# EAGLE design TQFP-DIP (EAGLE 6.1)
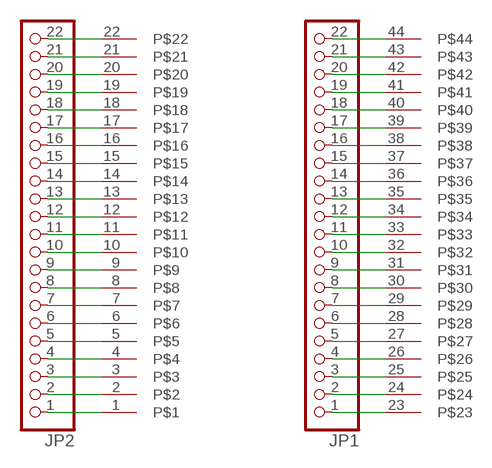
[diagram p0: schematic, sheet 1]

## Parts
JP1  PINHD-1X22  [1X22]
JP2  PINHD-1X22  [1X22]
U$1  TQFP44  [TQFP44]

## Nets
N$1: JP2.1 U$1.1
N$2: JP2.2 U$1.2
N$3: JP2.3 U$1.3
N$4: JP2.4 U$1.4
N$5: JP2.5 U$1.5
N$6: JP2.6 U$1.6
N$7: JP2.7 U$1.7
N$8: JP2.8 U$1.8
N$9: JP2.9 U$1.9
N$10: JP2.10 U$1.10
N$11: JP2.11 U$1.11
N$12: JP2.12 U$1.12
N$13: JP2.13 U$1.13
N$14: JP2.14 U$1.14
N$15: JP2.15 U$1.15
N$16: JP2.16 U$1.16
N$17: JP2.17 U$1.17
N$18: JP2.18 U$1.18
N$19: JP2.19 U$1.19
N$20: JP2.20 U$1.20
N$21: JP2.21 U$1.21
N$22: JP2.22 U$1.22
N$23: JP1.1 U$1.23
N$24: JP1.2 U$1.24
N$25: JP1.3 U$1.25
N$26: JP1.4 U$1.26
N$27: JP1.5 U$1.27
N$28: JP1.6 U$1.28
N$29: JP1.7 U$1.29
N$30: JP1.8 U$1.30
N$31: JP1.9 U$1.31
N$32: JP1.10 U$1.32
N$33: JP1.11 U$1.33
N$34: JP1.12 U$1.34
N$35: JP1.13 U$1.35
N$36: JP1.14 U$1.36
N$37: JP1.15 U$1.37
N$38: JP1.16 U$1.38
N$39: JP1.17 U$1.39
N$40: JP1.18 U$1.40
N$41: JP1.19 U$1.41
N$42: JP1.20 U$1.42
N$43: JP1.21 U$1.43
N$44: JP1.22 U$1.44

## Library data of the parts
JP1 JP2 = pinhead:PINHD-1X22: PIN HEADER
U$1 = SparkFun:TQFP44

## Board
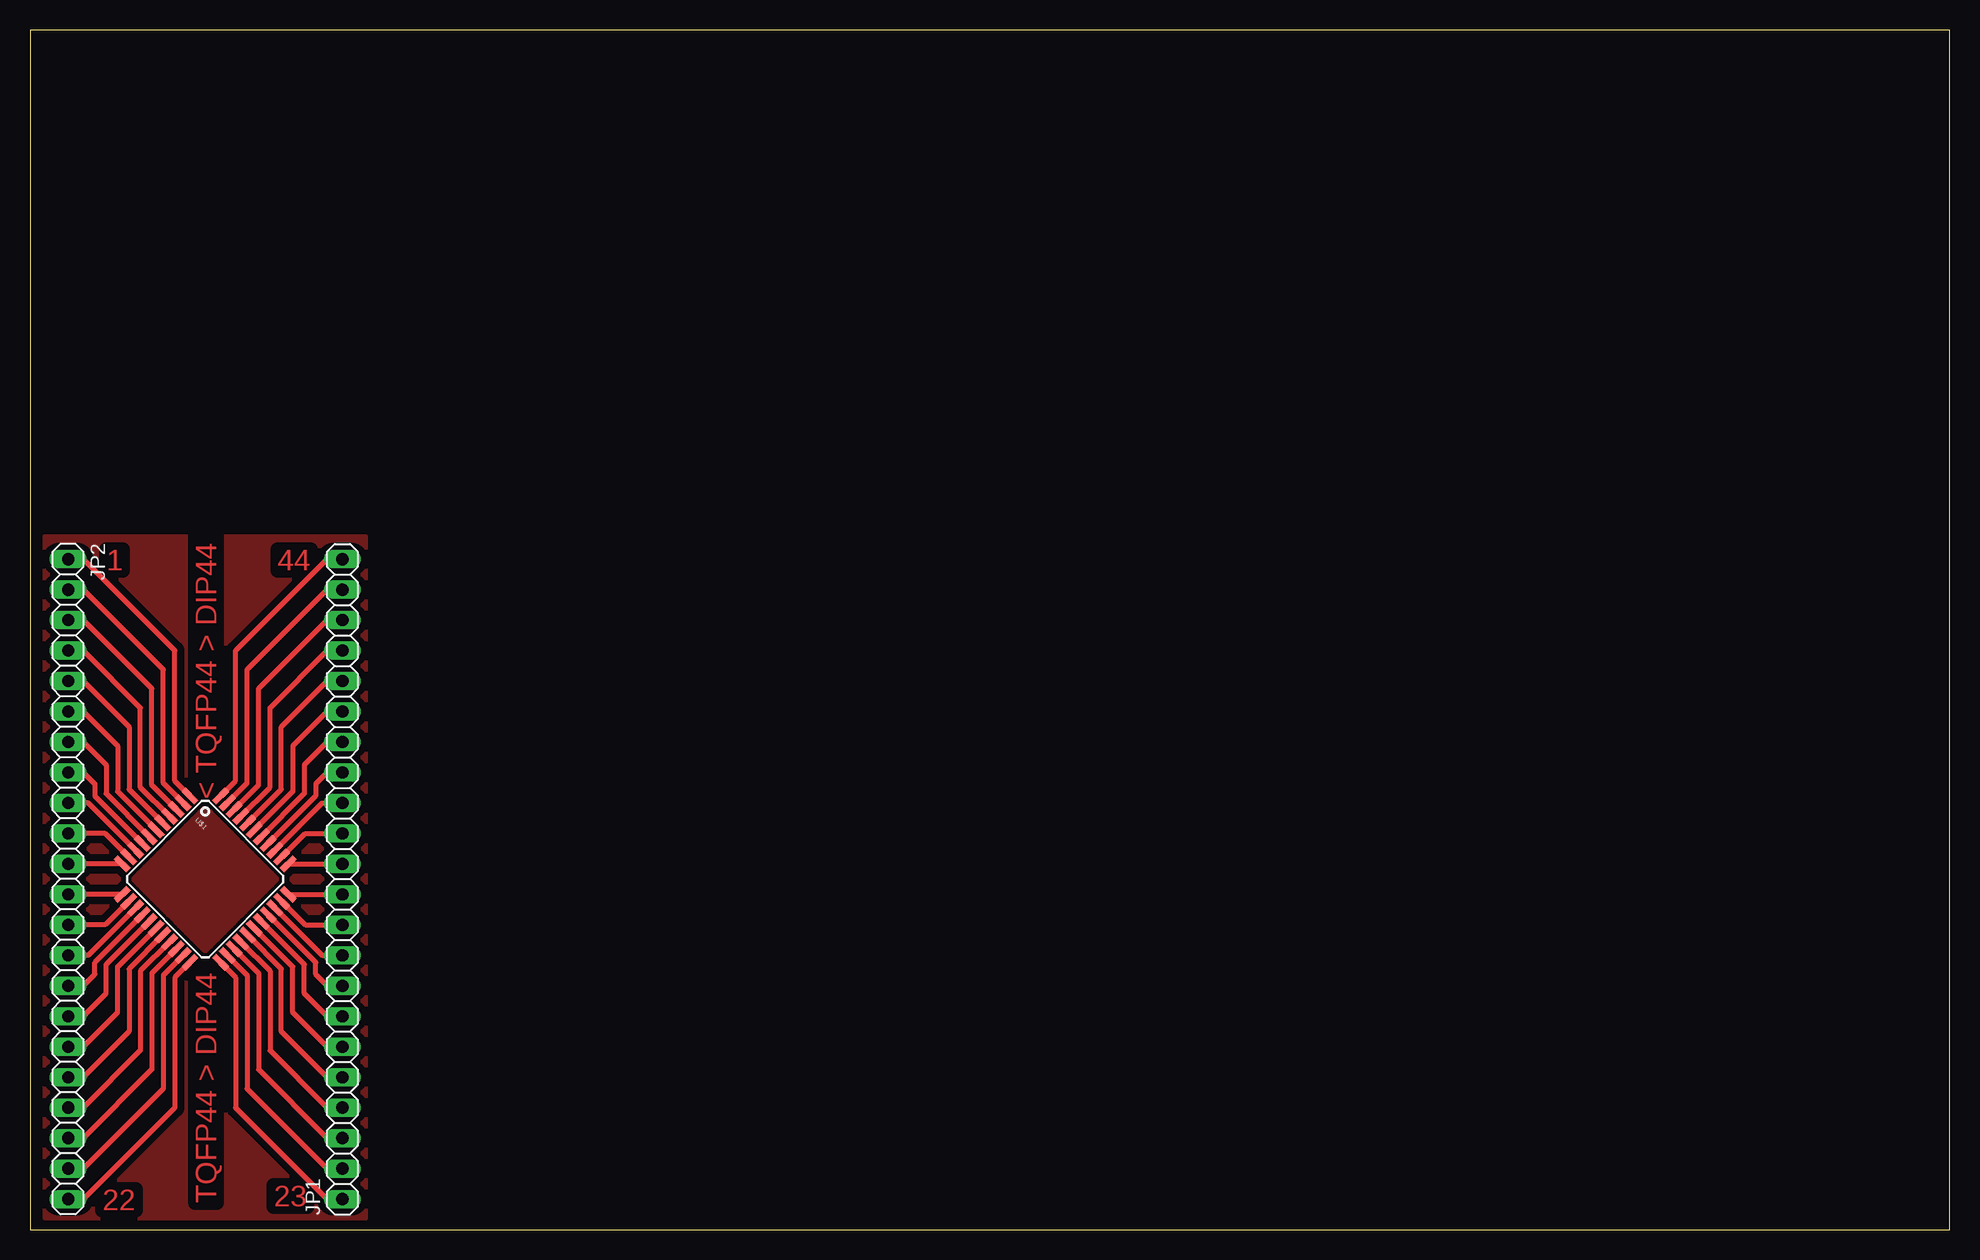
[diagram p1: board, top side]

Size 160 x 100 mm. Coordinates in mm from the lower left corner, seen from the top.
Outline: 0,0 160,0 160,100 0,100 0,0
Copper layers (1*16): Top 0.035mm / dielectric 1.5mm / Bottom 0.035mm
Design rules: minimum track width 10mil, minimum drill 24mil, track to track 12mil, track to pad 12mil, pad to pad 12mil, via to via 12mil, smd to smd 10mil, copper to edge 12mil, drill to drill 12mil, minimum pad ring 10mil, minimum via ring 10mil, stop-mask expansion 4mil, vias tented up to drill 0mil, thermal gap 12mil

### Footprints (pad centres in the part's own frame; a part is rotated, then mirrored left to right if it is on the bottom)
1X22 = drill 1.016 long: 1 -26.67,0; 2 -24.13,0; 3 -21.59,0; 4 -19.05,0; 5 -16.51,0; 6 -13.97,0; 7 -11.43,0; 8 -8.89,0; 9 -6.35,0; 10 -3.81,0; 11 -1.27,0; 12 1.27,0; 13 3.81,0; 14 6.35,0; 15 8.89,0; 16 11.43,0; 17 13.97,0; 18 16.51,0; 19 19.05,0; 20 21.59,0; 21 24.13,0; 22 26.67,0
TQFP44 = smd 1.5 x 0.5: 1 -5.8,4; 2 -5.8,3.2; 3 -5.8,2.4; 4 -5.8,1.6; 5 -5.8,0.8; 6 -5.8,0; 7 -5.8,-0.8; 8 -5.8,-1.6; 9 -5.8,-2.4; 10 -5.8,-3.2; 11 -5.8,-4; 23 5.8,-4; 24 5.8,-3.2; 25 5.8,-2.4; 26 5.8,-1.6; 27 5.8,-0.8; 28 5.8,0; 29 5.8,0.8; 30 5.8,1.6; 31 5.8,2.4; 32 5.8,3.2; 33 5.8,4 | smd 0.5 x 1.5: 12 -4,-5.8; 13 -3.2,-5.8; 14 -2.4,-5.8; 15 -1.6,-5.8; 16 -0.8,-5.8; 17 0,-5.8; 18 0.8,-5.8; 19 1.6,-5.8; 20 2.4,-5.8; 21 3.2,-5.8; 22 4,-5.8; 34 4,5.8; 35 3.2,5.8; 36 2.4,5.8; 37 1.6,5.8; 38 0.8,5.8; 39 0,5.8; 40 -0.8,5.8; 41 -1.6,5.8; 42 -2.4,5.8; 43 -3.2,5.8; 44 -4,5.8

### Placement (x,y rotation side)
JP1  26.04,29.21 90 top
JP2  3.17,29.21 270 top
U$1  14.61,29.21 315 top

### Tracks (layer width: path | path; a pad name or v marks a point on that pad's centre or on a via)
N$1
  Top 0.406: JP2.1 4.45,55.88 12.06,48.26 12.06,37.41 U$1.1
N$2
  Top 0.406: JP2.2 4.45,53.34 11.11,46.67 11.11,37.23 U$1.2
N$3
  Top 0.406: JP2.3 4.45,50.8 10.16,45.09 10.16,37.05 U$1.3
N$4
  Top 0.406: JP2.4 4.45,48.26 9.21,43.5 9.21,36.87 U$1.4
N$5
  Top 0.406: JP2.5 4.45,45.72 8.26,41.91 8.26,36.69 U$1.5
N$6
  Top 0.406: JP2.6 4.45,43.18 7.3,40.32 7.3,36.51 U$1.6
N$7
  Top 0.406: JP2.7 4.45,40.64 6.35,38.73 6.35,36.33 U$1.7
N$8
  Top 0.406: JP2.8 4.45,38.1 5.4,37.15 5.4,36.16 U$1.8
N$9
  Top 0.406: U$1.9 4.86,35.56 JP2.9
N$10
  Top 0.406: U$1.10 6.27,33.02 JP2.10
N$11
  Top 0.406: U$1.11 JP2.11
N$12
  Top 0.406: U$1.12 JP2.12
N$13
  Top 0.406: U$1.13 6.27,25.4 JP2.13
N$14
  Top 0.406: U$1.14 4.86,22.86 JP2.14
N$15
  Top 0.406: JP2.15 4.45,20.32 5.4,21.27 5.4,22.27 U$1.15
N$16
  Top 0.406: JP2.16 4.45,17.78 6.35,19.68 6.35,22.09 U$1.16
N$17
  Top 0.406: JP2.17 4.45,15.24 7.3,18.1 7.3,21.91 U$1.17
N$18
  Top 0.406: JP2.18 4.45,12.7 8.26,16.51 8.26,21.73 U$1.18
N$19
  Top 0.406: JP2.19 4.45,10.16 9.21,14.92 9.21,21.55 U$1.19
N$20
  Top 0.406: JP2.20 4.45,7.62 10.16,13.34 10.16,21.37 U$1.20
N$21
  Top 0.406: JP2.21 4.45,5.08 11.11,11.75 11.11,21.19 U$1.21
N$22
  Top 0.406: JP2.22 4.45,2.54 12.06,10.16 12.06,21.01 U$1.22
N$23
  Top 0.406: JP1.1 24.77,2.54 17.14,10.16 17.14,21.01 U$1.23
N$24
  Top 0.406: JP1.2 24.77,5.08 18.1,11.75 18.1,21.19 U$1.24
N$25
  Top 0.406: JP1.3 24.77,7.62 19.05,13.34 19.05,21.37 U$1.25
N$26
  Top 0.406: JP1.4 24.77,10.16 20,14.92 20,21.55 U$1.26
N$27
  Top 0.406: JP1.5 24.77,12.7 20.95,16.51 20.95,21.73 U$1.27
N$28
  Top 0.406: JP1.6 24.77,15.24 21.91,18.1 21.91,21.91 U$1.28
N$29
  Top 0.406: JP1.7 24.77,17.78 22.86,19.68 22.86,22.09 U$1.29
N$30
  Top 0.406: JP1.8 24.77,20.32 23.81,21.27 23.81,22.27 U$1.30
N$31
  Top 0.406: U$1.31 24.35,22.86 JP1.9
N$32
  Top 0.406: U$1.32 22.94,25.4 JP1.10
N$33
  Top 0.406: U$1.33 JP1.11
N$34
  Top 0.406: U$1.34 JP1.12
N$35
  Top 0.406: U$1.35 22.94,33.02 JP1.13
N$36
  Top 0.406: U$1.36 24.35,35.56 JP1.14
N$37
  Top 0.406: JP1.15 24.77,38.1 23.81,37.15 23.81,36.16 U$1.37
N$38
  Top 0.406: JP1.16 24.77,40.64 22.86,38.73 22.86,36.33 U$1.38
N$39
  Top 0.406: JP1.17 24.77,43.18 21.91,40.32 21.91,36.51 U$1.39
N$40
  Top 0.406: JP1.18 24.77,45.72 20.95,41.91 20.95,36.69 U$1.40
N$41
  Top 0.406: JP1.19 24.77,48.26 20,43.5 20,36.87 U$1.41
N$42
  Top 0.406: JP1.20 24.77,50.8 19.05,45.09 19.05,37.05 U$1.42
N$43
  Top 0.406: JP1.21 24.77,53.34 18.1,46.67 18.1,37.23 U$1.43
N$44
  Top 0.406: JP1.22 24.77,55.88 17.14,48.26 17.14,37.41 U$1.44
N$45
  pour Top (isolate 0.61): 1.27,0.95 1.27,57.78 27.94,57.78 27.94,0.95

### Text on the board
Top: 1 | 44 | < TQFP44 > DIP44 | 22 | TQFP44 > DIP44 | 23